# EAGLE schematic rcfilter (EAGLE 8.4.0)
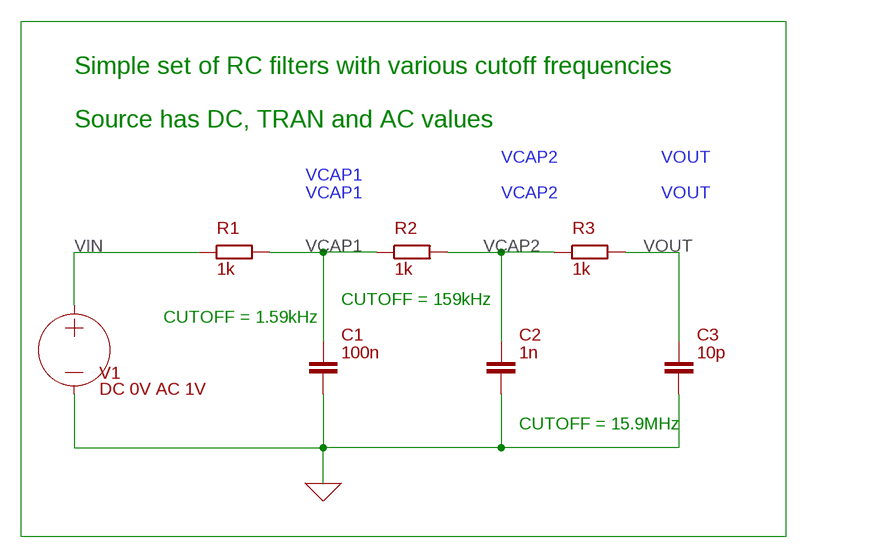
[diagram p0: schematic, sheet 1]

## Parts
C1  100n  C  (no package)
C2  1n  C  (no package)
C3  10p  C  (no package)
R1  1k  R  (no package)
R2  1k  R  (no package)
R3  1k  R  (no package)
V1  DC 0V AC 1V  VOLTAGE  (no package)

## Nets
0: C1.2 C2.2 C3.2 V1.- ; supply symbol labelled GND
VCAP1: C1.1 R1.2 R2.1
VCAP2: C2.1 R2.2 R3.1
VIN: R1.1 V1.+
VOUT: C3.1 R3.2

## Notes on the sheet
- Simple set of RC filters with various cutoff frequencies
  
  Source has DC, TRAN and AC values
- CUTOFF = 159kHz
- CUTOFF = 1.59kHz
- CUTOFF = 15.9MHz

## Library data of the parts
C1-C3 = ngspice-simulation:C: CAPACITOR
R1-R3 = ngspice-simulation:R: RESISTOR
V1 = ngspice-simulation:VOLTAGE: Independent Voltage Source, either DC, AC, PULSE, SINE, PWL, EXP, or SFFM; VALUE: 0V